# Altium schematic sheet NBP11 Xilinx Spartan-III BGA456 Rev1.01.SchDoc: Spartan III BGA456 Daughterboard
size A2; Author: Ch.W.; Organization: Altium Limited; Address1: L3, 12a Rodborough Rd; Address2: Frenchs Forest; Address3: NSW; Address4: Australia 2086; DocumentNumber: 1; Revision: 1.01; SheetNumber: 1; SheetTotal: 1; DocumentName: Spartan III BGA456 Daughterboard
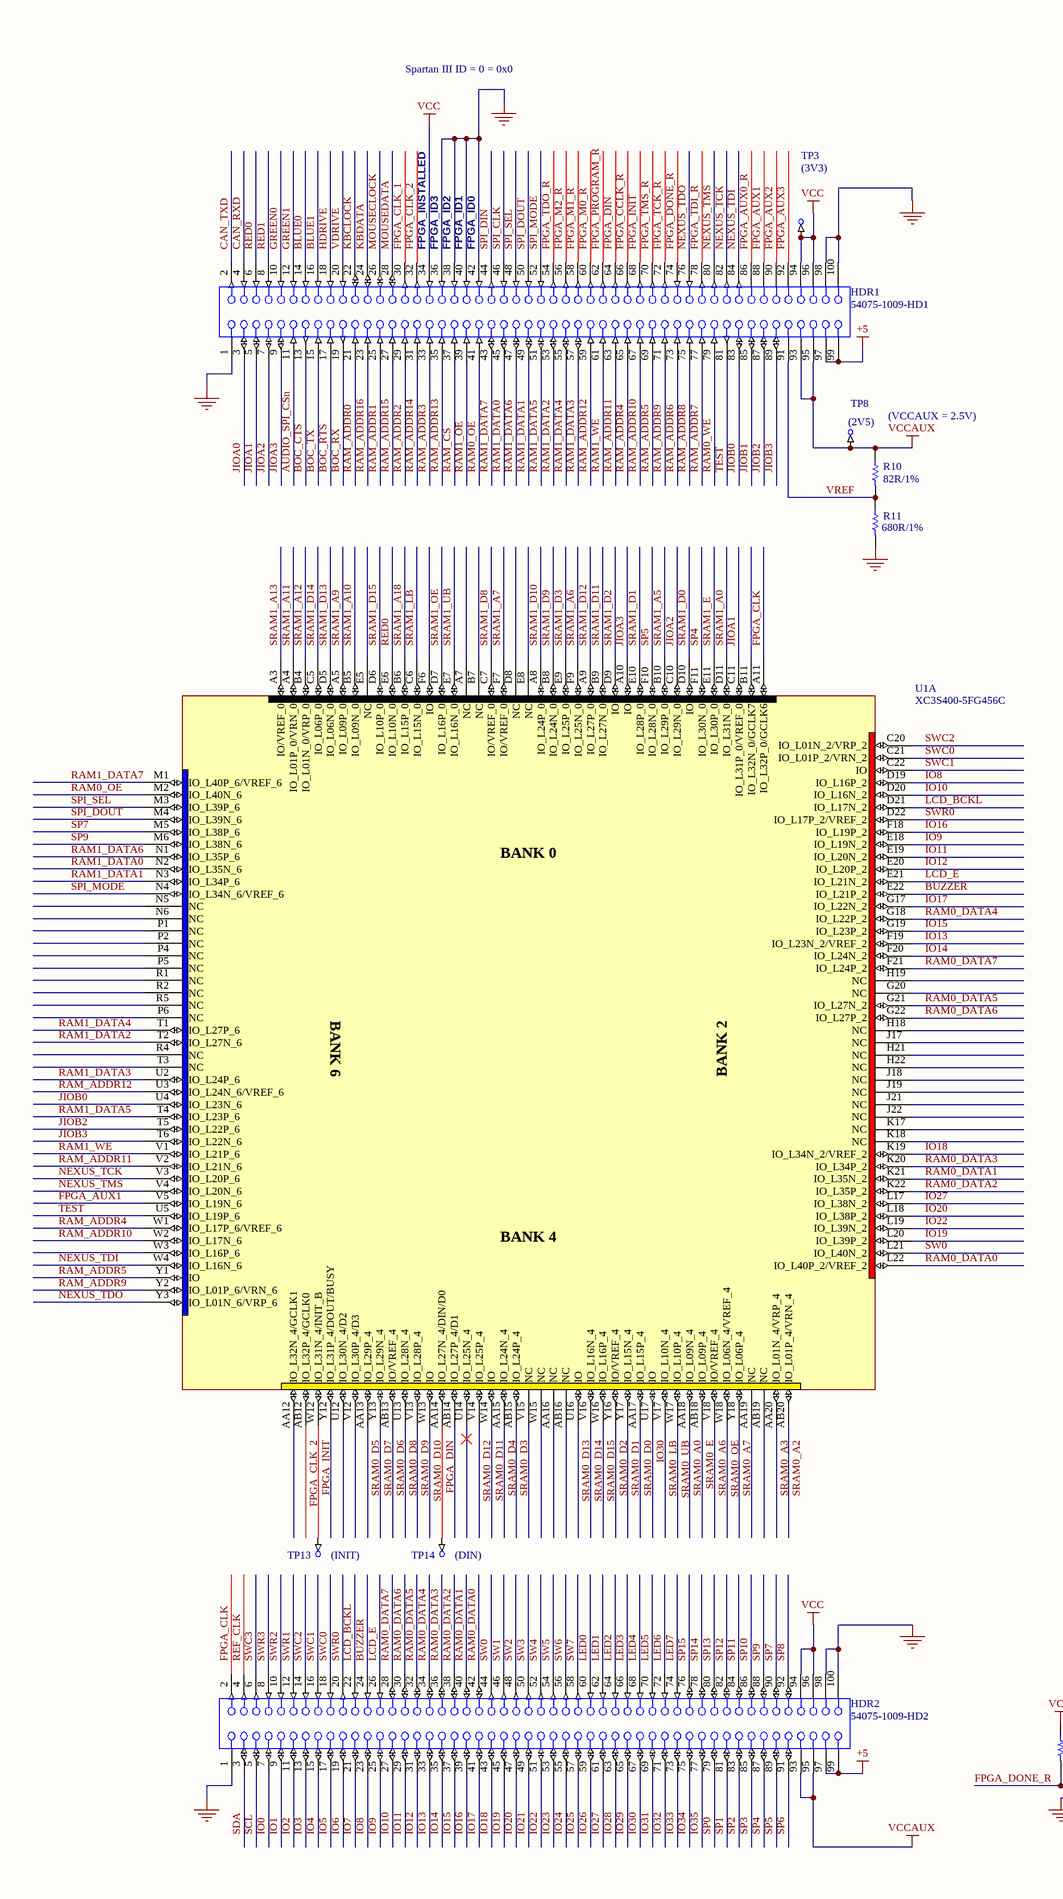
[diagram p0: NBP11 Xilinx Spartan-III BGA456 Rev1.01.SchDoc, left]
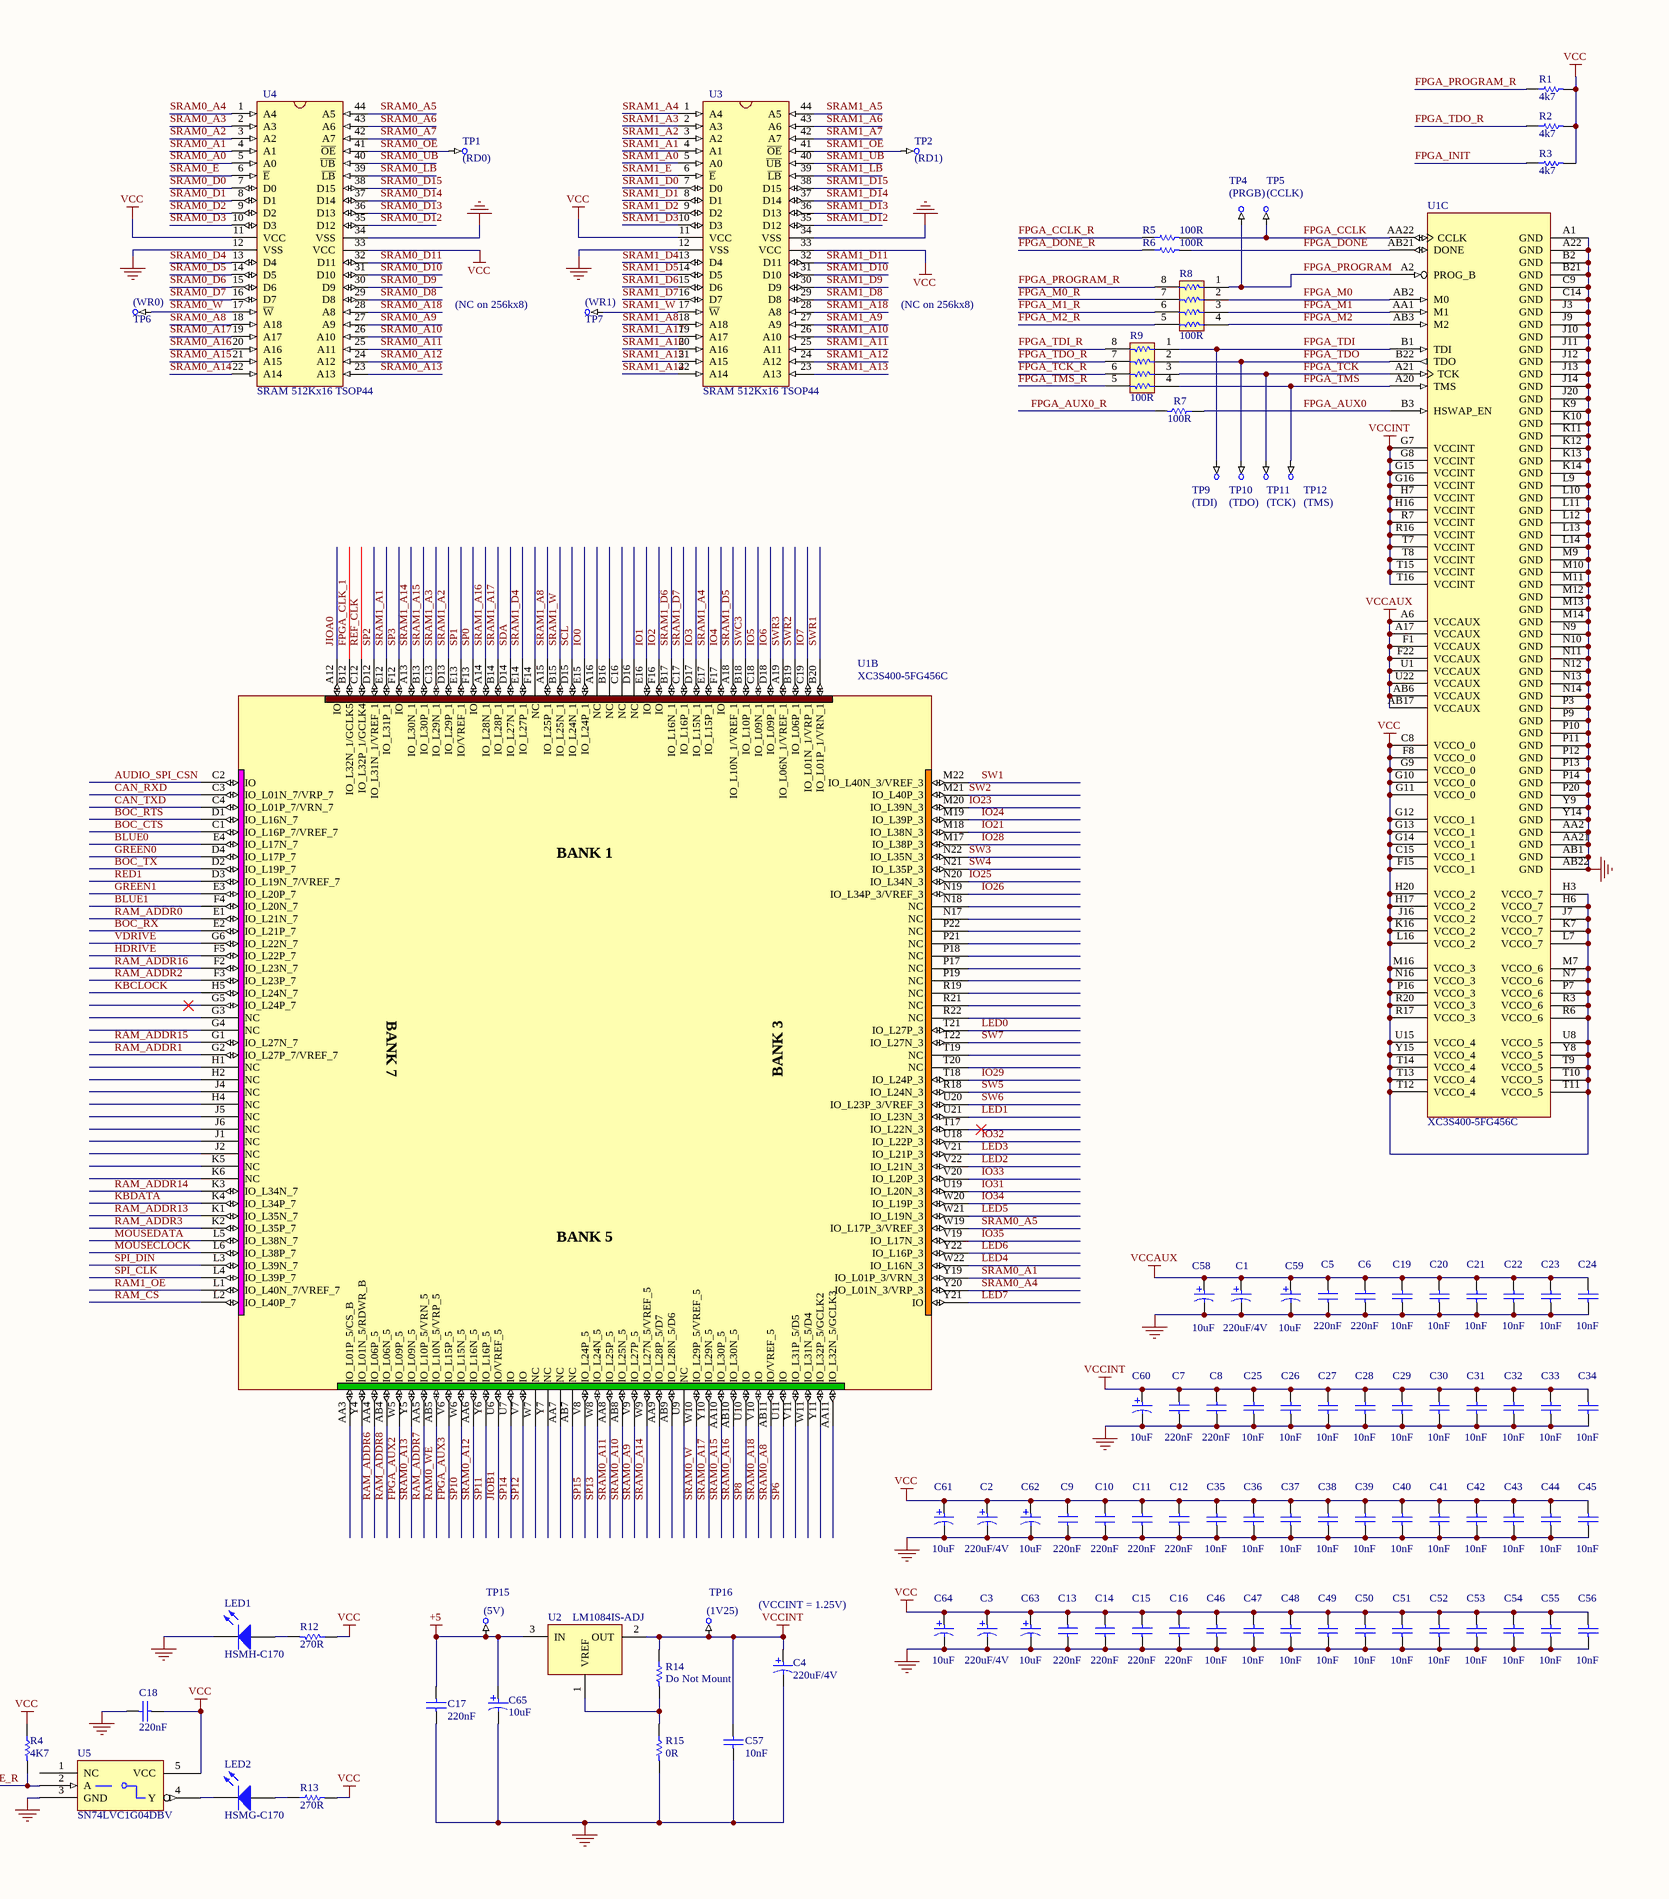
[diagram p1: NBP11 Xilinx Spartan-III BGA456 Rev1.01.SchDoc, right]

## Parts
C1  220uF/4V  [MCCT-D]
C2  220uF/4V  [MCCT-D]
C3  220uF/4V  [MCCT-D]
C4  220uF/4V  [MCCT-D]
C5  220nF  [CC1608-0603]
C6  220nF  [CC1608-0603]
C7  220nF  [CC1608-0603]
C8  220nF  [CC1608-0603]
C9  220nF  [CC1608-0603]
C10  220nF  [CC1608-0603]
C11  220nF  [CC1608-0603]
C12  220nF  [CC1608-0603]
C13  220nF  [CC1608-0603]
C14  220nF  [CC1608-0603]
C15  220nF  [CC1608-0603]
C16  220nF  [CC1608-0603]
C17  220nF  [CC1608-0603]
C18  220nF  [CC1608-0603]
C19  10nF  [CC1608-0603]
C20  10nF  [CC1608-0603]
C21  10nF  [CC1608-0603]
C22  10nF  [CC1608-0603]
C23  10nF  [CC1608-0603]
C24  10nF  [CC1608-0603]
C25  10nF  [CC1608-0603]
C26  10nF  [CC1608-0603]
C27  10nF  [CC1608-0603]
C28  10nF  [CC1608-0603]
C29  10nF  [CC1608-0603]
C30  10nF  [CC1608-0603]
C31  10nF  [CC1608-0603]
C32  10nF  [CC1608-0603]
C33  10nF  [CC1608-0603]
C34  10nF  [CC1608-0603]
C35  10nF  [CC1608-0603]
C36  10nF  [CC1608-0603]
C37  10nF  [CC1608-0603]
C38  10nF  [CC1608-0603]
C39  10nF  [CC1608-0603]
C40  10nF  [CC1608-0603]
C41  10nF  [CC1608-0603]
C42  10nF  [CC1608-0603]
C43  10nF  [CC1608-0603]
C44  10nF  [CC1608-0603]
C45  10nF  [CC1608-0603]
C46  10nF  [CC1608-0603]
C47  10nF  [CC1608-0603]
C48  10nF  [CC1608-0603]
C49  10nF  [CC1608-0603]
C50  10nF  [CC1608-0603]
C51  10nF  [CC1608-0603]
C52  10nF  [CC1608-0603]
C53  10nF  [CC1608-0603]
C54  10nF  [CC1608-0603]
C55  10nF  [CC1608-0603]
C56  10nF  [CC1608-0603]
C57  10nF  [CC1608-0603]
C58  10uF  [MCCT-B]
C59  10uF  [MCCT-B]
C60  10uF  [MCCT-B]
C61  10uF  [MCCT-B]
C62  10uF  [MCCT-B]
C63  10uF  [MCCT-B]
C64  10uF  [MCCT-B]
C65  10uF  [MCCT-B]
HDR1  54075-1009-HD1  [54075]
HDR2  54075-1009-HD2  [54075]
LED1  HSMH-C170  [SMD _LED]
LED2  HSMG-C170  [SMD _LED]
R1  4k7  [CR2012-0805]
R2  4k7  [CR2012-0805]
R3  4k7  [CR2012-0805]
R4  4K7  [CR2012-0805]
R5  100R  [CR2012-0805]
R6  100R  [CR2012-0805]
R7  100R  [CR2012-0805]
R8  100R  [MNR34]
R9  100R  [MNR34]
R10  82R/1%  [CR2012-0805]
R11  680R/1%  [CR2012-0805]
R12  270R  [CR2012-0805]
R13  270R  [CR2012-0805]
R14  Do Not Mount  [CR2012-0805]
R15  0R  [CR2012-0805]
TP1  (RD0)  [TestPin]  (no BOM)
TP2  (RD1)  [TestPin]  (no BOM)
TP3  (3V3)  [TestPin]  (no BOM)
TP4  (PRGB)  [TestPin]  (no BOM)
TP5  (CCLK)  [TestPin]  (no BOM)
TP6  (WR0)  [TestPin]  (no BOM)
TP7  (WR1)  [TestPin]  (no BOM)
TP8  (2V5)  [TestPin]  (no BOM)
TP9  (TDI)  [TestPin]  (no BOM)
TP10  (TDO)  [TestPin]  (no BOM)
TP11  (TCK)  [TestPin]  (no BOM)
TP12  (TMS)  [TestPin]  (no BOM)
TP13  (INIT)  [TestPin]  (no BOM)
TP14  (DIN)  [TestPin]  (no BOM)
TP15  (5V)  [TestPin]  (no BOM)
TP16  (1V25)  [TestPin]  (no BOM)
U1  XC3S400-5FG456C  [FG456]  (parts A,B,C of 3)
U2  LM1084IS-ADJ  [TO-263]
U3  SRAM 512Kx16 TSOP44  [SO-G44/P.8]
U4  SRAM 512Kx16 TSOP44  [SO-G44/P.8]
U5  SN74LVC1G04DBV  [SO-G5/P.95]

## Nets
+5: C17.1 C65.1 HDR1.97 HDR1.99 HDR2.97 HDR2.99 TP15.1 U2.3(IN)
GND: C1.2 C2.2 C3.2 C4.2 C5.2 C6.2 C7.2 C8.2 C9.2 C10.2 C11.2 C12.2 C13.2 C14.2 C15.2 C16.2 C17.2 C18.1 C19.2 C20.2 C21.2 C22.2 C23.2 C24.2 C25.2 C26.2 C27.2 C28.2 C29.2 C30.2 C31.2 C32.2 C33.2 C34.2 C35.2 C36.2 C37.2 C38.2 C39.2 C40.2 C41.2 C42.2 C43.2 C44.2 C45.2 C46.2 C47.2 C48.2 C49.2 C50.2 C51.2 C52.2 C53.2 C54.2 C55.2 C56.2 C57.2 C58.2 C59.2 C60.2 C61.2 C62.2 C63.2 C64.2 C65.2 HDR1.1 HDR1.36 HDR1.38 HDR1.40 HDR1.42 HDR1.98 HDR1.100 HDR2.1 HDR2.98 HDR2.100 LED1.2(K) R11.2 R15.2 U1.A1(GND) U1.A22(GND) U1.AA2(GND) U1.AA21(GND) U1.AB1(GND) U1.AB22(GND) U1.B2(GND) U1.B21(GND) U1.C9(GND) U1.C14(GND) U1.J3(GND) U1.J9(GND) U1.J10(GND) U1.J11(GND) U1.J12(GND) U1.J13(GND) U1.J14(GND) U1.J20(GND) U1.K9(GND) U1.K10(GND) U1.K11(GND) U1.K12(GND) U1.K13(GND) U1.K14(GND) U1.L9(GND) U1.L10(GND) U1.L11(GND) U1.L12(GND) U1.L13(GND) U1.L14(GND) U1.M9(GND) U1.M10(GND) U1.M11(GND) U1.M12(GND) U1.M13(GND) U1.M14(GND) U1.N9(GND) U1.N10(GND) U1.N11(GND) U1.N12(GND) U1.N13(GND) U1.N14(GND) U1.P3(GND) U1.P9(GND) U1.P10(GND) U1.P11(GND) U1.P12(GND) U1.P13(GND) U1.P14(GND) U1.P20(GND) U1.Y9(GND) U1.Y14(GND) U3.12(VSS) U3.34(VSS) U4.12(VSS) U4.34(VSS) U5.3(GND)
VCC: C2.1 C3.1 C9.1 C10.1 C11.1 C12.1 C13.1 C14.1 C15.1 C16.1 C18.2 C35.1 C36.1 C37.1 C38.1 C39.1 C40.1 C41.1 C42.1 C43.1 C44.1 C45.1 C46.1 C47.1 C48.1 C49.1 C50.1 C51.1 C52.1 C53.1 C54.1 C55.1 C56.1 C61.1 C62.1 C63.1 C64.1 HDR1.34 HDR1.94 HDR1.96 HDR2.94 HDR2.96 R1.2 R2.2 R3.2 R4.1 R12.1 R13.2 TP3.1 U1.C8(VCCO_0) U1.C15(VCCO_1) U1.F8(VCCO_0) U1.F15(VCCO_1) U1.G9(VCCO_0) U1.G10(VCCO_0) U1.G11(VCCO_0) U1.G12(VCCO_1) U1.G13(VCCO_1) U1.G14(VCCO_1) U1.H3(VCCO_7) U1.H6(VCCO_7) U1.H17(VCCO_2) U1.H20(VCCO_2) U1.J7(VCCO_7) U1.J16(VCCO_2) U1.K7(VCCO_7) U1.K16(VCCO_2) U1.L7(VCCO_7) U1.L16(VCCO_2) U1.M7(VCCO_6) U1.M16(VCCO_3) U1.N7(VCCO_6) U1.N16(VCCO_3) U1.P7(VCCO_6) U1.P16(VCCO_3) U1.R3(VCCO_6) U1.R6(VCCO_6) U1.R17(VCCO_3) U1.R20(VCCO_3) U1.T9(VCCO_5) U1.T10(VCCO_5) U1.T11(VCCO_5) U1.T12(VCCO_4) U1.T13(VCCO_4) U1.T14(VCCO_4) U1.U8(VCCO_5) U1.U15(VCCO_4) U1.Y8(VCCO_5) U1.Y15(VCCO_4) U3.11(VCC) U3.33(VCC) U4.11(VCC) U4.33(VCC) U5.5(VCC)
VCCAUX: C1.1 C5.1 C6.1 C19.1 C20.1 C21.1 C22.1 C23.1 C24.1 C58.1 C59.1 HDR1.93 HDR1.95 HDR2.93 HDR2.95 R10.1 TP8.1 U1.A6(VCCAUX) U1.A17(VCCAUX) U1.AB6(VCCAUX) U1.AB17(VCCAUX) U1.F1(VCCAUX) U1.F22(VCCAUX) U1.U1(VCCAUX) U1.U22(VCCAUX)
VCCINT: C4.1 C7.1 C8.1 C25.1 C26.1 C27.1 C28.1 C29.1 C30.1 C31.1 C32.1 C33.1 C34.1 C57.1 C60.1 R14.1 TP16.1 U1.G7(VCCINT) U1.G8(VCCINT) U1.G15(VCCINT) U1.G16(VCCINT) U1.H7(VCCINT) U1.H16(VCCINT) U1.R7(VCCINT) U1.R16(VCCINT) U1.T7(VCCINT) U1.T8(VCCINT) U1.T15(VCCINT) U1.T16(VCCINT) U2.2(OUT)
AUDIO_SPI_CSn: HDR1.11 U1.C2(IO)
BLUE0: HDR1.14 U1.E4(IO_L17N_7)
BLUE1: HDR1.16 U1.F4(IO_L20N_7)
BOC_CTS: HDR1.13 U1.C1(IO_L16P_7/VREF_7)
BOC_RTS: HDR1.17 U1.D1(IO_L16N_7)
BOC_RX: HDR1.19 U1.E2(IO_L21P_7)
BOC_TX: HDR1.15 U1.D2(IO_L19P_7)
BUZZER: HDR2.24 U1.E22(IO_L21P_2)
CAN_RXD: HDR1.4 U1.C3(IO_L01N_7/VRP_7)
CAN_TXD: HDR1.2 U1.C4(IO_L01P_7/VRN_7)
FPGA_AUX0: R7.1 U1.B3(HSWAP_EN)
FPGA_AUX0_R: HDR1.86 R7.2
FPGA_AUX1: HDR1.88 U1.V5(IO_L19N_6)
FPGA_AUX2: HDR1.90 U1.W5(IO_L09P_5)
FPGA_AUX3: HDR1.92 U1.V6(IO_L15P_5)
FPGA_CCLK: R5.2 TP5.1 U1.AA22(CCLK)
FPGA_CCLK_R: HDR1.66 R5.1
FPGA_CLK: HDR2.2 U1.A11(IO_L32P_0/GCLK6)
FPGA_CLK_1: HDR1.30 U1.B12(IO_L32N_1/GCLK5)
FPGA_CLK_2: HDR1.32 U1.AB12(IO_L32P_4/GCLK0)
FPGA_DIN: HDR1.64 TP14.1 U1.AA14(IO_L27N_4/DIN/D0)
FPGA_DONE: R6.2 U1.AB21(DONE)
FPGA_DONE_R: HDR1.74 R4.2 R6.1 U5.2(A)
FPGA_INIT: HDR1.68 R3.1 TP13.1 U1.W12(IO_L31N_4/INIT_B)
FPGA_M0: R8.2 U1.AB2(M0)
FPGA_M0_R: HDR1.60 R8.7
FPGA_M1: R8.3 U1.AA1(M1)
FPGA_M1_R: HDR1.58 R8.6
FPGA_M2: R8.4 U1.AB3(M2)
FPGA_M2_R: HDR1.56 R8.5
FPGA_PROGRAM: R8.1 TP4.1 U1.A2(PROG_B)
FPGA_PROGRAM_R: HDR1.62 R1.1 R8.8
FPGA_TCK: R9.3 TP11.1 U1.A21(TCK)
FPGA_TCK_R: HDR1.72 R9.6
FPGA_TDI: R9.1 TP9.1 U1.B1(TDI)
FPGA_TDI_R: HDR1.78 R9.8
FPGA_TDO: R9.2 TP10.1 U1.B22(TDO)
FPGA_TDO_R: HDR1.54 R2.1 R9.7
FPGA_TMS: R9.4 TP12.1 U1.A20(TMS)
FPGA_TMS_R: HDR1.70 R9.5
GREEN0: HDR1.10 U1.D4(IO_L17P_7)
GREEN1: HDR1.12 U1.E3(IO_L20P_7)
HDRIVE: HDR1.18 U1.F5(IO_L22P_7)
IO0: HDR2.7 U1.E15(IO_L24P_1)
IO1: HDR2.9 U1.E16(IO)
IO2: HDR2.11 U1.F16(IO)
IO3: HDR2.13 U1.D17(IO_L15N_1)
IO4: HDR2.15 U1.F17(IO)
IO5: HDR2.17 U1.C18(IO_L09N_1)
IO6: HDR2.19 U1.D18(IO_L09P_1)
IO7: HDR2.21 U1.C19(IO_L01N_1/VRP_1)
IO8: HDR2.23 U1.D19(IO_L16P_2)
IO9: HDR2.25 U1.E18(IO_L19N_2)
IO10: HDR2.27 U1.D20(IO_L16N_2)
IO11: HDR2.29 U1.E19(IO_L20N_2)
IO12: HDR2.31 U1.E20(IO_L20P_2)
IO13: HDR2.33 U1.F19(IO_L23N_2/VREF_2)
IO14: HDR2.35 U1.F20(IO_L24N_2)
IO15: HDR2.37 U1.G19(IO_L23P_2)
IO16: HDR2.39 U1.F18(IO_L19P_2)
IO17: HDR2.41 U1.G17(IO_L22N_2)
IO18: HDR2.43 U1.K19(IO_L34N_2/VREF_2)
IO19: HDR2.45 U1.L20(IO_L39P_2)
IO20: HDR2.47 U1.L18(IO_L38P_2)
IO21: HDR2.49 U1.M18(IO_L38N_3)
IO22: HDR2.51 U1.L19(IO_L39N_2)
IO23: HDR2.53 U1.M20(IO_L39N_3)
IO24: HDR2.55 U1.M19(IO_L39P_3)
IO25: HDR2.57 U1.N20(IO_L34N_3)
IO26: HDR2.59 U1.N19(IO_L34P_3/VREF_3)
IO27: HDR2.61 U1.L17(IO_L38N_2)
IO28: HDR2.63 U1.M17(IO_L38P_3)
IO29: HDR2.65 U1.T18(IO_L24P_3)
IO30: HDR2.67 U1.U17(IO)
IO31: HDR2.69 U1.U19(IO_L20N_3)
IO32: HDR2.71 U1.U18(IO_L22P_3)
IO33: HDR2.73 U1.V20(IO_L20P_3)
IO34: HDR2.75 U1.W20(IO_L19P_3)
IO35: HDR2.77 U1.V19(IO_L17N_3)
JIOA0: HDR1.3 U1.A12(IO)
JIOA1: HDR1.5 U1.C11(IO_L31P_0/VREF_0)
JIOA2: HDR1.7 U1.C10(IO_L29N_0)
JIOA3: HDR1.9 U1.A10(IO)
JIOB0: HDR1.83 U1.U4(IO_L23N_6)
JIOB1: HDR1.85 U1.U6(IO/VREF_5)
JIOB2: HDR1.87 U1.T5(IO_L22P_6)
JIOB3: HDR1.89 U1.T6(IO_L22N_6)
KBCLOCK: HDR1.22 U1.H5(IO_L24N_7)
KBDATA: HDR1.24 U1.K4(IO_L34P_7)
LCD_BCKL: HDR2.22 U1.D21(IO_L17N_2)
LCD_E: HDR2.26 U1.E21(IO_L21N_2)
LED0: HDR2.60 U1.T21(IO_L27P_3)
LED1: HDR2.62 U1.U21(IO_L23N_3)
LED2: HDR2.64 U1.V22(IO_L21N_3)
LED3: HDR2.66 U1.V21(IO_L21P_3)
LED4: HDR2.68 U1.W22(IO_L16N_3)
LED5: HDR2.70 U1.W21(IO_L19N_3)
LED6: HDR2.72 U1.Y22(IO_L16P_3)
LED7: HDR2.74 U1.Y21(IO)
MOUSECLOCK: HDR1.26 U1.L6(IO_L38P_7)
MOUSEDATA: HDR1.28 U1.L5(IO_L38N_7)
NEXUS_TCK: HDR1.82 U1.V3(IO_L20P_6)
NEXUS_TDI: HDR1.84 U1.W4(IO_L16N_6)
NEXUS_TDO: HDR1.76 U1.Y3(IO_L01N_6/VRP_6)
NEXUS_TMS: HDR1.80 U1.V4(IO_L20N_6)
RAM0_DATA0: HDR2.42 U1.L22(IO_L40P_2/VREF_2)
RAM0_DATA1: HDR2.40 U1.K21(IO_L35N_2)
RAM0_DATA2: HDR2.38 U1.K22(IO_L35P_2)
RAM0_DATA3: HDR2.36 U1.K20(IO_L34P_2)
RAM0_DATA4: HDR2.34 U1.G18(IO_L22P_2)
RAM0_DATA5: HDR2.32 U1.G21(IO_L27N_2)
RAM0_DATA6: HDR2.30 U1.G22(IO_L27P_2)
RAM0_DATA7: HDR2.28 U1.F21(IO_L24P_2)
RAM0_OE: HDR1.41 U1.M2(IO_L40N_6)
RAM0_WE: HDR1.79 U1.AB5(IO_L10N_5/VRP_5)
RAM1_DATA0: HDR1.45 U1.N2(IO_L35N_6)
RAM1_DATA1: HDR1.49 U1.N3(IO_L34P_6)
RAM1_DATA2: HDR1.53 U1.T2(IO_L27N_6)
RAM1_DATA3: HDR1.57 U1.U2(IO_L24P_6)
RAM1_DATA4: HDR1.55 U1.T1(IO_L27P_6)
RAM1_DATA5: HDR1.51 U1.T4(IO_L23P_6)
RAM1_DATA6: HDR1.47 U1.N1(IO_L35P_6)
RAM1_DATA7: HDR1.43 U1.M1(IO_L40P_6/VREF_6)
RAM1_OE: HDR1.39 U1.L1(IO_L40N_7/VREF_7)
RAM1_WE: HDR1.61 U1.V1(IO_L21P_6)
RAM_ADDR0: HDR1.21 U1.E1(IO_L21N_7)
RAM_ADDR1: HDR1.25 U1.G2(IO_L27P_7/VREF_7)
RAM_ADDR2: HDR1.29 U1.F3(IO_L23P_7)
RAM_ADDR3: HDR1.33 U1.K2(IO_L35P_7)
RAM_ADDR4: HDR1.65 U1.W1(IO_L17P_6/VREF_6)
RAM_ADDR5: HDR1.69 U1.Y1(IO)
RAM_ADDR6: HDR1.73 U1.AA4(IO_L06P_5)
RAM_ADDR7: HDR1.77 U1.AA5(IO_L10P_5/VRN_5)
RAM_ADDR8: HDR1.75 U1.AB4(IO_L06N_5)
RAM_ADDR9: HDR1.71 U1.Y2(IO_L01P_6/VRN_6)
RAM_ADDR10: HDR1.67 U1.W2(IO_L17N_6)
RAM_ADDR11: HDR1.63 U1.V2(IO_L21N_6)
RAM_ADDR12: HDR1.59 U1.U3(IO_L24N_6/VREF_6)
RAM_ADDR13: HDR1.35 U1.K1(IO_L35N_7)
RAM_ADDR14: HDR1.31 U1.K3(IO_L34N_7)
RAM_ADDR15: HDR1.27 U1.G1(IO_L27N_7)
RAM_ADDR16: HDR1.23 U1.F2(IO_L23N_7)
RAM_CS: HDR1.37 U1.L2(IO_L40P_7)
RED0: HDR1.6 U1.E6(IO_L10N_0)
RED1: HDR1.8 U1.D3(IO_L19N_7/VREF_7)
REF_CLK: HDR2.4 U1.C12(IO_L32P_1/GCLK4)
SCL: HDR2.5 U1.D15(IO_L24N_1)
SDA: HDR2.3 U1.D14(IO_L27N_1)
SP0: HDR2.79 U1.F13(IO)
SP1: HDR2.81 U1.E13(IO/VREF_1)
SP2: HDR2.83 U1.D12(IO_L31N_1/VREF_1)
SP3: HDR2.85 U1.F12(IO)
SP4: HDR2.87 U1.F11(IO_L30N_0)
SP5: HDR2.89 U1.F10(IO_L28N_0)
SP6: HDR2.91 U1.U11(IO)
SP7: HDR2.90 U1.M5(IO_L38P_6)
SP8: HDR2.92 U1.U10(IO)
SP9: HDR2.88 U1.M6(IO_L38N_6)
SP10: HDR2.86 U1.W6(IO_L15N_5)
SP11: HDR2.84 U1.Y6(IO_L16P_5)
SP12: HDR2.82 U1.V7(IO)
SP13: HDR2.80 U1.W8(IO_L24N_5)
SP14: HDR2.78 U1.U7(IO)
SP15: HDR2.76 U1.V8(IO_L24P_5)
SPI_CLK: HDR1.46 U1.L4(IO_L39P_7)
SPI_DIN: HDR1.44 U1.L3(IO_L39N_7)
SPI_DOUT: HDR1.50 U1.M4(IO_L39N_6)
SPI_MODE: HDR1.52 U1.N4(IO_L34N_6/VREF_6)
SPI_SEL: HDR1.48 U1.M3(IO_L39P_6)
SRAM0_A0: U1.AA18(IO_L09N_4) U3.5(A0)
SRAM0_A1: U1.Y19(IO_L01P_3/VRN_3) U3.4(A1)
SRAM0_A2: U1.AB20(IO_L01P_4/VRN_4) U3.3(A2)
SRAM0_A3: U1.AA20(IO_L01N_4/VRP_4) U3.2(A3)
SRAM0_A4: U1.Y20(IO_L01N_3/VRP_3) U3.1(A4)
SRAM0_A5: U1.W19(IO_L17P_3/VREF_3) U3.44(A5)
SRAM0_A6: U1.V18(IO/VREF_4) U3.43(A6)
SRAM0_A7: U1.Y18(IO_L06P_4) U3.42(A7)
SRAM0_A8: U1.AB11(IO/VREF_5) U3.18(A18)
SRAM0_A9: U1.V9(IO_L27P_5) U3.27(A9)
SRAM0_A10: U1.AB8(IO_L25N_5) U3.26(A10)
SRAM0_A11: U1.AA8(IO_L25P_5) U3.25(A11)
SRAM0_A12: U1.AA6(IO_L16N_5) U3.24(A12)
SRAM0_A13: U1.Y5(IO_L09N_5) U3.23(A13)
SRAM0_A14: U1.W9(IO_L27N_5/VREF_5) U3.22(A14)
SRAM0_A15: U1.AA10(IO_L30P_5) U3.21(A15)
SRAM0_A16: U1.AB10(IO_L30N_5) U3.20(A16)
SRAM0_A17: U1.Y10(IO_L29N_5) U3.19(A17)
SRAM0_A18: U1.V10(IO) U3.28(A8)
SRAM0_D0: U1.AA17(IO_L15P_4) U3.7(D0)
SRAM0_D1: U1.Y17(IO_L15N_4) U3.8(D1)
SRAM0_D2: U1.Y16(IO/VREF_4) U3.9(D2)
SRAM0_D3: U1.AB15(IO_L24P_4) U3.10(D3)
SRAM0_D4: U1.AA15(IO_L24N_4) U3.13(D4)
SRAM0_D5: U1.AA13(IO_L29P_4) U3.14(D5)
SRAM0_D6: U1.AB13(IO/VREF_4) U3.15(D6)
SRAM0_D7: U1.Y13(IO_L29N_4) U3.16(D7)
SRAM0_D8: U1.U13(IO_L28N_4) U3.29(D8)
SRAM0_D9: U1.V13(IO_L28P_4) U3.30(D9)
SRAM0_D10: U1.W13(IO) U3.31(D10)
SRAM0_D11: U1.W14(IO) U3.32(D11)
SRAM0_D12: U1.V14(IO_L25P_4) U3.35(D12)
SRAM0_D13: U1.U16(IO) U3.36(D13)
SRAM0_D14: U1.V16(IO_L16N_4) U3.37(D14)
SRAM0_D15: U1.W16(IO_L16P_4) U3.38(D15)
SRAM0_E: U1.AB18(IO_L09P_4) U3.6(~{E})
SRAM0_LB: U1.V17(IO_L10N_4) U3.39(~{LB})
SRAM0_OE: TP1.1 U1.W18(IO_L06N_4/VREF_4) U3.41(~{OE})
SRAM0_UB: U1.W17(IO_L10P_4) U3.40(~{UB})
SRAM0_W: TP6.1 U1.W10(IO_L29P_5/VREF_5) U3.17(~{W})
SRAM1_A0: U1.D11(IO_L31N_0) U4.5(A0)
SRAM1_A1: U1.E12(IO_L31P_1) U4.4(A1)
SRAM1_A2: U1.D13(IO_L29P_1) U4.3(A2)
SRAM1_A3: U1.C13(IO_L29N_1) U4.2(A3)
SRAM1_A4: U1.E17(IO_L15P_1) U4.1(A4)
SRAM1_A5: U1.B10(IO_L29P_0) U4.44(A5)
SRAM1_A6: U1.F9(IO_L25N_0) U4.43(A6)
SRAM1_A7: U1.F7(IO/VREF_0) U4.42(A7)
SRAM1_A8: U1.A15(IO_L25P_1) U4.18(A18)
SRAM1_A9: U1.A5(IO_L09P_0) U4.27(A9)
SRAM1_A10: U1.B5(IO_L09N_0) U4.26(A10)
SRAM1_A11: U1.A4(IO_L01P_0/VRN_0) U4.25(A11)
SRAM1_A12: U1.B4(IO_L01N_0/VRP_0) U4.24(A12)
SRAM1_A13: U1.A3(IO/VREF_0) U4.23(A13)
SRAM1_A14: U1.A13(IO_L30N_1) U4.22(A14)
SRAM1_A15: U1.B13(IO_L30P_1) U4.21(A15)
SRAM1_A16: U1.A14(IO_L28N_1) U4.20(A16)
SRAM1_A17: U1.B14(IO_L28P_1) U4.19(A17)
SRAM1_A18: U1.B6(IO_L15P_0) U4.28(A8)
SRAM1_D0: U1.D10(IO) U4.7(D0)
SRAM1_D1: U1.E10(IO_L28P_0) U4.8(D1)
SRAM1_D2: U1.D9(IO) U4.9(D2)
SRAM1_D3: U1.E9(IO_L25P_0) U4.10(D3)
SRAM1_D4: U1.E14(IO_L27P_1) U4.13(D4)
SRAM1_D5: U1.A18(IO_L10N_1/VREF_1) U4.14(D5)
SRAM1_D6: U1.B17(IO_L16N_1) U4.15(D6)
SRAM1_D7: U1.C17(IO_L16P_1) U4.16(D7)
SRAM1_D8: U1.C7(IO/VREF_0) U4.29(D8)
SRAM1_D9: U1.B8(IO_L24N_0) U4.30(D9)
SRAM1_D10: U1.A8(IO_L24P_0) U4.31(D10)
SRAM1_D11: U1.B9(IO_L27N_0) U4.32(D11)
SRAM1_D12: U1.A9(IO_L27P_0) U4.35(D12)
SRAM1_D13: U1.D5(IO_L06N_0) U4.36(D13)
SRAM1_D14: U1.C5(IO_L06P_0) U4.37(D14)
SRAM1_D15: U1.D6(IO_L10P_0) U4.38(D15)
SRAM1_E: U1.E11(IO_L30P_0) U4.6(~{E})
SRAM1_LB: U1.C6(IO_L15N_0) U4.39(~{LB})
SRAM1_OE: TP2.1 U1.D7(IO_L16P_0) U4.41(~{OE})
SRAM1_UB: U1.E7(IO_L16N_0) U4.40(~{UB})
SRAM1_W: TP7.1 U1.B15(IO_L25N_1) U4.17(~{W})
SW0: HDR2.44 U1.L21(IO_L40N_2)
SW1: HDR2.46 U1.M22(IO_L40N_3/VREF_3)
SW2: HDR2.48 U1.M21(IO_L40P_3)
SW3: HDR2.50 U1.N22(IO_L35N_3)
SW4: HDR2.52 U1.N21(IO_L35P_3)
SW5: HDR2.54 U1.R18(IO_L24N_3)
SW6: HDR2.56 U1.U20(IO_L23P_3/VREF_3)
SW7: HDR2.58 U1.T22(IO_L27N_3)
SWC0: HDR2.18 U1.C21(IO_L01P_2/VRN_2)
SWC1: HDR2.16 U1.C22(IO)
SWC2: HDR2.14 U1.C20(IO_L01N_2/VRP_2)
SWC3: HDR2.6 U1.B18(IO_L10P_1)
SWR0: HDR2.20 U1.D22(IO_L17P_2/VREF_2)
SWR1: HDR2.12 U1.B20(IO_L01P_1/VRN_1)
SWR2: HDR2.10 U1.B19(IO_L06P_1)
SWR3: HDR2.8 U1.A19(IO_L06N_1/VREF_1)
TEST: HDR1.81 U1.U5(IO_L19P_6)
VDRIVE: HDR1.20 U1.G6(IO_L22N_7)
VREF: HDR1.91 R10.2 R11.1
NetLED1_1: LED1.1(A) R12.2
NetLED2_1: LED2.1(A) R13.1
NetLED2_2: LED2.2(K) U5.4(Y)
NetR14_2: R14.2 R15.1 U2.1(VREF)

Not connected (* = marked no-connect by the designer): U1 A7(NC) A16(NC) AA3(IO_L01P_5/CS_B) AA7(NC) AA9(IO_L28P_5/D7) AA11(IO_L32N_5/GCLK3) AA12(IO_L32N_4/GCLK1) AA16(NC) AA19(NC) AB7(NC) AB9(IO_L28N_5/D6) AB14(IO_L27P_4/D1) AB16(NC) AB19(NC) B7(NC) B11(IO_L32N_0/GCLK7) B16(NC) C16(NC) D8(NC) D16(NC) E5(NC) E8(NC) F6(IO) F14(NC) G3(NC) G4(NC) G5(IO_L24P_7)* G20(NC) H1(NC) H2(NC) H4(NC) H18(NC) H19(NC) H21(NC) H22(NC) J1(NC) J2(NC) J4(NC) J5(NC) J6(NC) J17(NC) J18(NC) J19(NC) J21(NC) J22(NC) K5(NC) K6(NC) K17(NC) K18(NC) N5(NC) N6(NC) N17(NC) N18(NC) P1(NC) P2(NC) P4(NC) P5(NC) P6(NC) P17(NC) P18(NC) P19(NC) P21(NC) P22(NC) R1(NC) R2(NC) R4(NC) R5(NC) R19(NC) R21(NC) R22(NC) T3(NC) T17(IO_L22N_3)* T19(NC) T20(NC) U9(NC) U12(IO_L30N_4/D2) U14(IO_L25N_4)* V11(IO_L31P_5/D5) V12(IO_L30P_4/D3) V15(NC) W3(IO_L16P_6) W7(NC) W11(IO_L31N_5/D4) W15(NC) Y4(IO_L01N_5/RDWR_B) Y7(NC) Y11(IO_L32P_5/GCLK2) Y12(IO_L31P_4/DOUT/BUSY); U5 1(NC)

## Notes on the sheet
- Spartan III ID = 0 = 0x0
- (near HDR1) FPGA_INSTALLED
- (near HDR1) FPGA_ID3
- (near HDR1) FPGA_ID2
- (near HDR1) FPGA_ID1
- (near HDR1) FPGA_ID0
- (NC on 256kx8)
- (VCCAUX = 2.5V)
- (VCCINT = 1.25V)
- Title
- Size:
- Date:
- File:
- A2
- Number:
- Time:
- Revision:
- Sheet
- of
- (in symbol XC3S400-5FG456C, part A) BANK 0; BANK 6; BANK 2; BANK 4
- (in symbol XC3S400-5FG456C, part B) BANK 1; BANK 7; BANK 3; BANK 5

## Library data of the parts
C1-C4 C58-C65 = CAP_POLAR: Polar Capacitor; Supplier: FARNELL
  C1-C4: Supplier Code: 355-1829
  C58-C65: Supplier Code: 967-117
C5-C57 = CAP: Capacitor; Supplier: FARNELL
  C5-C18: Supplier Code: 335-2020
  C19-C57: Supplier Code: 772-236
HDR1 = 54075-1009-HD1: Board-to-Board, Docking Station, 0.80mm (.031") Pitch, Shielded Receptacle, Vertical, Ultra Low Profile, SMT; Manufacturer: Molex; Package Information: Latest Revision: Jun-2001; Mating Height: 8.5mm; Voltage: 100V; Current: 0.5A; Contact Resistance: 40mOhm max; PCB Layout: Complies with Manufacturer's Recommendation.; Published: 15-Oct-2003; Datasheet: Latest Revision: Feb-2002; Package Reference: 54075; Publisher: Altium Limited
HDR2 = 54075-1009-HD2: Board-to-Board, Docking Station, 0.80mm (.031") Pitch, Shielded Receptacle, Vertical, Ultra Low Profile, SMT; Manufacturer: Molex; Package Information: Latest Revision: Jun-2001; Mating Height: 8.5mm; Voltage: 100V; Current: 0.5A; Contact Resistance: 40mOhm max; PCB Layout: Complies with Manufacturer's Recommendation.; Published: 15-Oct-2003; Datasheet: Latest Revision: Feb-2002; Package Reference: 54075; Publisher: Altium Limited
LED1 LED2 = HSMX-C670: Typical RED GaAs SMD LED Agilent make; Manufacturer: Generic Components; Class I: Optoelectronic; Fitted: True; Published: 8-Jun-2000; Revision: July-2002: Re-released for DXP Platform.; Publisher: Altium Limited; Class II: LED
R1-R7 R10-R15 = RES: Resistor
R8 R9 = MNR34: 3216x4 Resistor Array
TP1-TP16 = TestPin
U1 = XC3S400-5FG456C: Spartan-3 1.2V FPGA, 264 User I/Os, 456-ball FBGA, High Performance, Commercial Grade; Package Information: Latest Revision: ver1.1, Apr-2001; Code - JEDEC: MO-151-AAJ-1; Published: 17-Sep-2003; Datasheet: Latest Revision: Dec-2003; Package Reference: FG456; Publisher: Altium Limited
U2 = LM1084IS-ADJ: 5A Low Dropout Possitive Regulators
U3 U4 = SRAM 512Kx16 TSOP44: 512Kx16Bit SRAM TSOP44; Supplier: IDT; Supplier Code: 71V416L10PH
U5 = SN74AHC1G04DBVR: Manufacturer: TI; Fitted: True